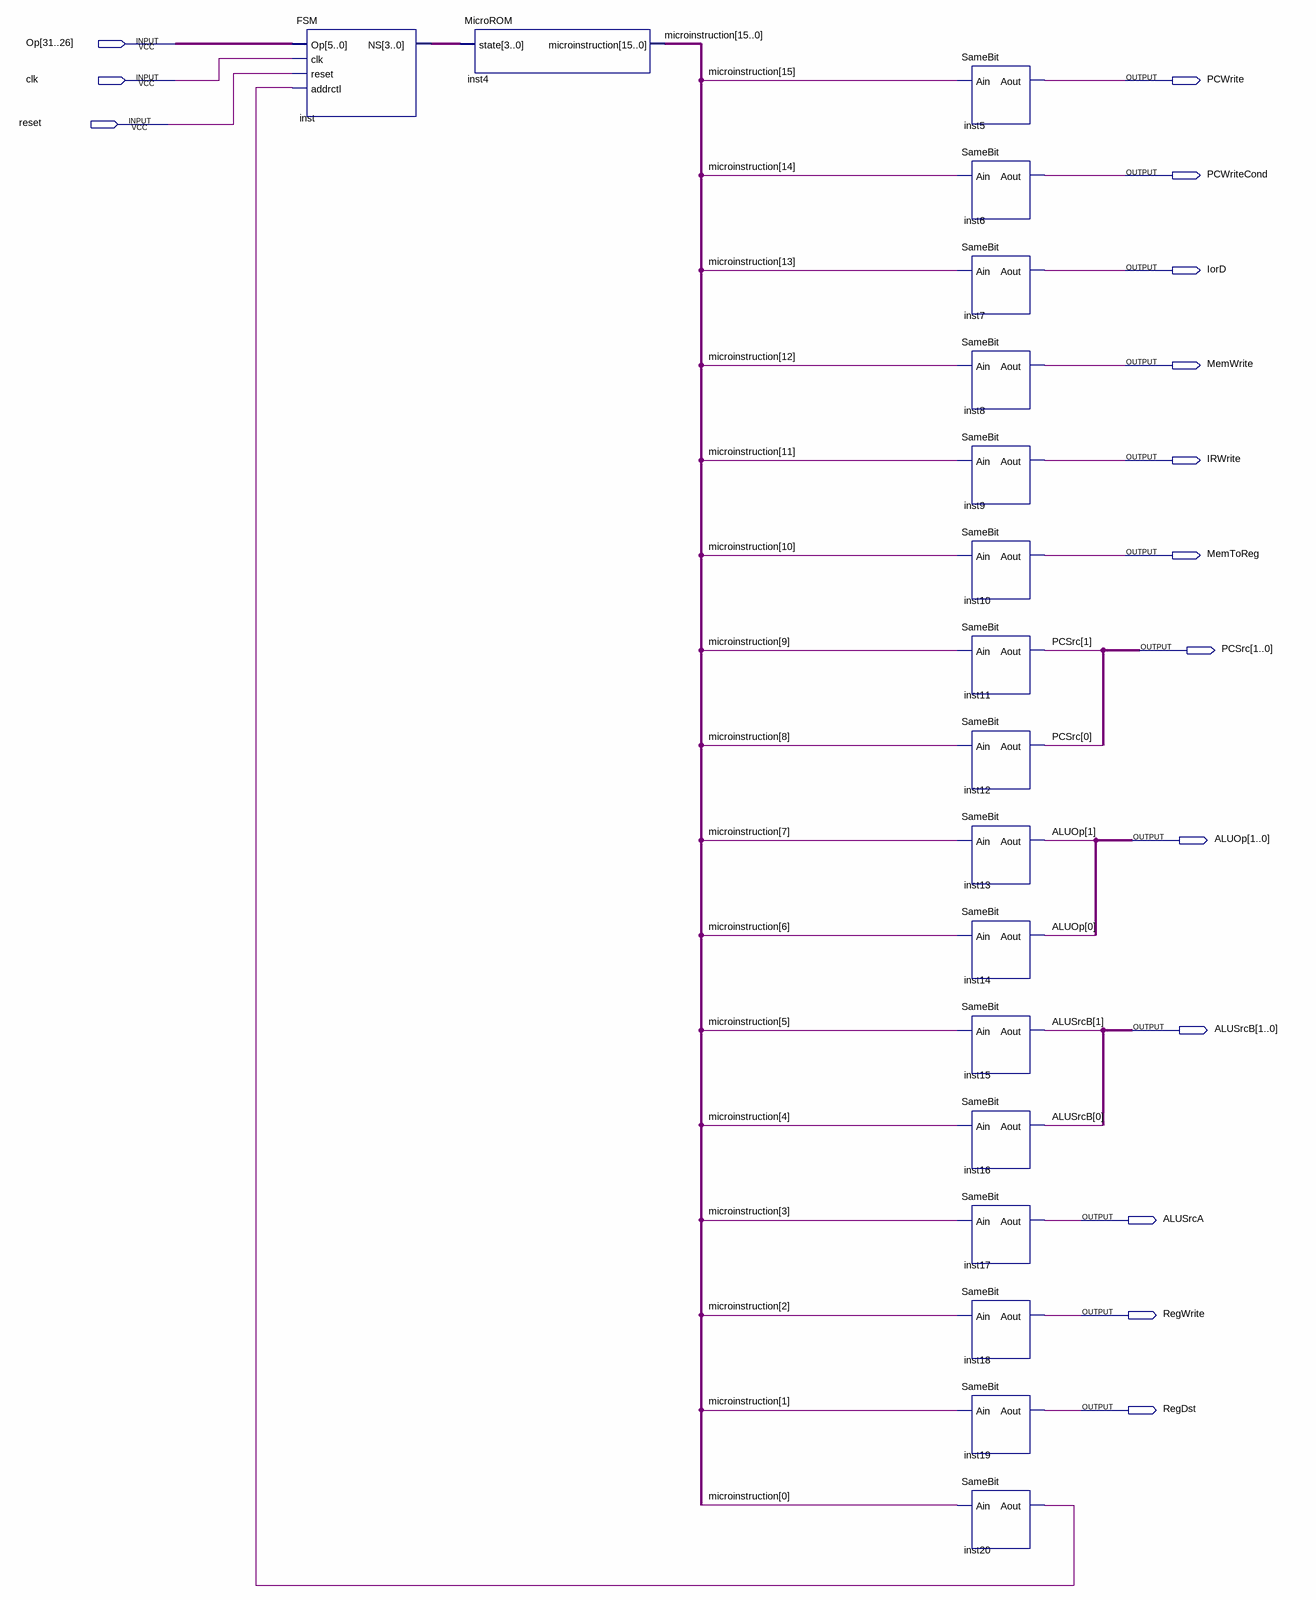
[diagram p0: schematic sheet]
// Quartus schematic CTRL.bdf as structural Verilog: 18 symbols, 15 pins
module CTRL (
  input  [31:26] Op,
  input  clk,
  input  reset,
  output PCWrite,
  output PCWriteCond,
  output IorD,
  output MemWrite,
  output IRWrite,
  output MemToReg,
  output [1:0] PCSrc,
  output [1:0] ALUOp,
  output [1:0] ALUSrcB,
  output ALUSrcA,
  output RegWrite,
  output RegDst
);

  wire inst20_aout;
  wire [3:0] inst_ns;
  wire [15:0] microinstruction;

  FSM inst (.Op(Op), .clk(clk), .reset(reset), .addrctl(inst20_aout), .NS(inst_ns));
  MicroROM inst4 (.state(inst_ns), .microinstruction(microinstruction));
  SameBit inst5 (.Ain(microinstruction[15]), .Aout(PCWrite));
  SameBit inst6 (.Ain(microinstruction[14]), .Aout(PCWriteCond));
  SameBit inst7 (.Ain(microinstruction[13]), .Aout(IorD));
  SameBit inst8 (.Ain(microinstruction[12]), .Aout(MemWrite));
  SameBit inst9 (.Ain(microinstruction[11]), .Aout(IRWrite));
  SameBit inst10 (.Ain(microinstruction[10]), .Aout(MemToReg));
  SameBit inst11 (.Ain(microinstruction[9]), .Aout(PCSrc[1]));
  SameBit inst12 (.Ain(microinstruction[8]), .Aout(PCSrc[0]));
  SameBit inst13 (.Ain(microinstruction[7]), .Aout(ALUOp[1]));
  SameBit inst14 (.Ain(microinstruction[6]), .Aout(ALUOp[0]));
  SameBit inst15 (.Ain(microinstruction[5]), .Aout(ALUSrcB[1]));
  SameBit inst16 (.Ain(microinstruction[4]), .Aout(ALUSrcB[0]));
  SameBit inst17 (.Ain(microinstruction[3]), .Aout(ALUSrcA));
  SameBit inst18 (.Ain(microinstruction[2]), .Aout(RegWrite));
  SameBit inst19 (.Ain(microinstruction[1]), .Aout(RegDst));
  SameBit inst20 (.Ain(microinstruction[0]), .Aout(inst20_aout));
endmodule
